# EasyEDA schematic SCH_fluffly_2_2024-03-27.json
TITLE: Sheet_1; REV: 1.0; Date: 2022-06-25; Sheet: 1/1; Company: Your Company
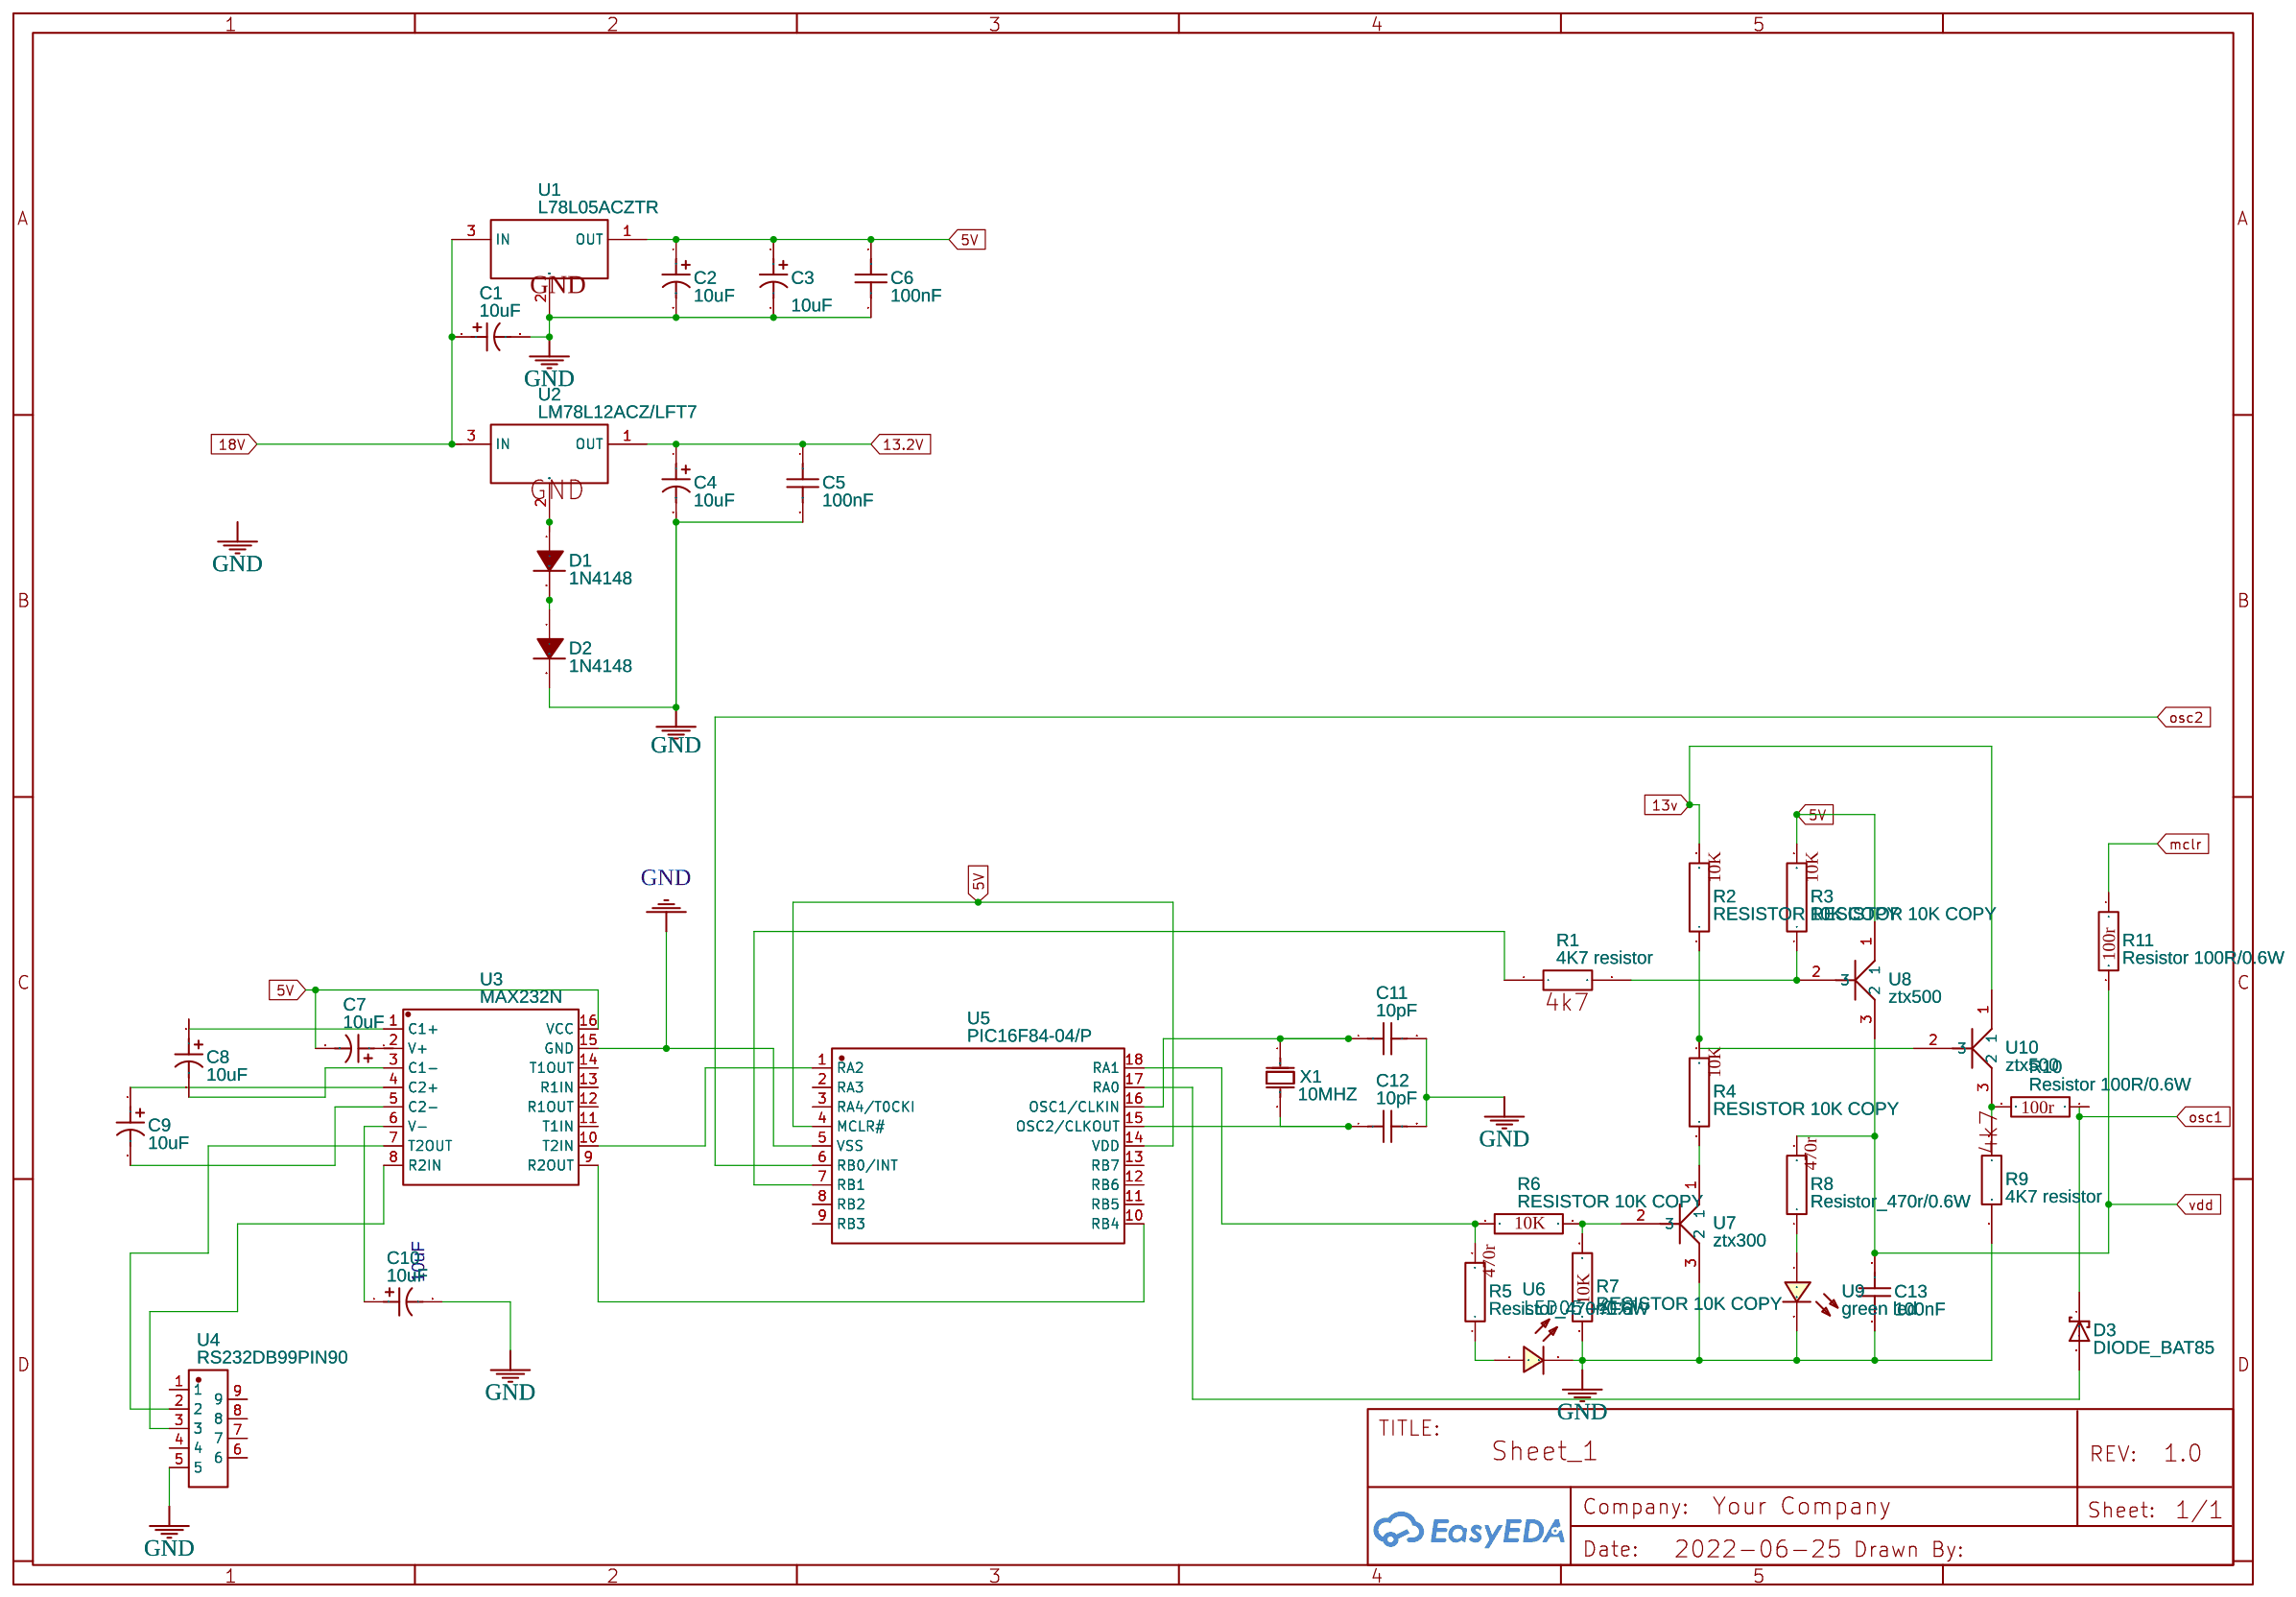
[diagram p0: schematic sheet]

## Parts
C1  10uF  [CAP-TH_BD8.0-P3.50-D0.6-FD_1]
C2  10uF  [CAP-TH_BD8.0-P3.50-D0.6-FD_1]
C3  10uF  [CAP-TH_BD8.0-P3.50-D0.6-FD_1]
C4  10uF  [CAP-TH_BD8.0-P3.50-D0.6-FD_1]
C5  100nF  [CAP-TH_L6.5-W3.0-P5.00-D0.6]
C6  100nF  [CAP-TH_L6.5-W3.0-P5.00-D0.6]
C7  10uF  [CAP-TH_BD8.0-P3.50-D0.6-FD_1]
C8  10uF  [CAP-TH_BD8.0-P3.50-D0.6-FD_1]
C9  10uF  [CAP-TH_BD8.0-P3.50-D0.6-FD_1]
C10  10uF  [CAP-TH_BD8.0-P3.50-D0.6-FD_1]
C11  10pF  [CAP-TH_L6.0-W3.5-P7.50-D1.0]
C12  10pF  [CAP-TH_L6.0-W3.5-P7.50-D1.0]
C13  100nF  [CAP-TH_L6.5-W3.0-P5.00-D0.6]
D1  1N4148  [DO-35_BD2.0-L4.0-P8.00-D0.5-FD]
D2  1N4148  [DO-35_BD2.0-L4.0-P8.00-D0.5-FD]
D3  DIODE_BAT85  [DIODE BAT85]
R1  4K7 resistor  [RESISTOR 4K7]
R2  RESISTOR 10K COPY  [RESISTOR 10K]
R3  RESISTOR 10K COPY  [RESISTOR 10K]
R4  RESISTOR 10K COPY  [RESISTOR 10K]
R5  Resistor_470r/0.6W  [ER_RESISTOR_470R/0.6_W]
R6  RESISTOR 10K COPY  [RESISTOR 10K]
R7  RESISTOR 10K COPY  [RESISTOR 10K]
R8  Resistor_470r/0.6W  [ER_RESISTOR_470R/0.6_W]
R9  4K7 resistor  [RESISTOR 4K7]
R10  Resistor 100R/0.6W  [ER RESISTOR 100R/0.6 W]
R11  Resistor 100R/0.6W  [ER RESISTOR 100R/0.6 W]
U1  L78L05ACZTR  [TO-92-3_L4.8-W3.7-P2.54-L]
U2  LM78L12ACZ/LFT7  [TO-92-3_L4.8-W3.7-P1.27-L]
U3  MAX232N  [PDIP-16_L19.7-W6.6-P2.54-LS7.8-BL]
U4  RS232DB99PIN90  [DB9-TH_DB9-H-F_C2888345]
U5  PIC16F84-04/P  [DIP-18_L23.0-W6.5-P2.54-LS7.6-BL]
U6  LED05-红灯  [LED-TH_LED-3MM_RED]
U7  ztx300  [TRANSISTOR]
U8  ztx500  [TRANSISTOR]
U9  green led  [LED-TH_LED-3MM_RED]
U10  ztx500  [TRANSISTOR]
X1  10MHZ  [OSC-TH_BD3.0-P1.10-D0.4]

## Library data of the parts
C1-C4 C7-C10 = RFS-50V100MG3#: Supplier: LCSC; Supplier Part: C2980594; Manufacturer: ELNA(伊娜); Contributor: lcsc; JLCPCB Part Class: Extended Part
C5 C6 C13 = DCS104Z26Y5VF58L5A0: Supplier: LCSC; Supplier Part: C2896068; Manufacturer: SHM(南方宏明); Contributor: lcsc
C11 C12 = CC45SL3FD100JYNNA: Supplier: LCSC; Supplier Part: C694205; Manufacturer: TDK; Contributor: LCSC; JLCPCB Part Class: Extended Part
D1 D2 = 1N4148: Supplier: LCSC; Manufacturer: SEMTECH; Supplier Part: C14516; JLCPCB Part Class: Extended Part
D3 = DIODE_BAT85: Contributor: Jr-YKZ
R1 R9 = 4K7 resistor: Contributor: enal007
R2-R4 R6 R7 = RESISTOR 10K COPY: Supplier Part: undefined; Contributor: pritams07
R5 R8 = Resistor_470r/0.6W: Supplier Part: undefined; Contributor: elpeewee
R10 R11 = Resistor 100R/0.6W: Supplier Part: undefined; Supplier: Conrad
U1 = L78L05ACZTR: Supplier: LCSC; Manufacturer: STMicroelectronics; Supplier Part: C118270; JLCPCB Part Class: Extended Part
U2 = LM78L12ACZ/LFT7: Supplier: LCSC; Supplier Part: C2868177; Manufacturer: TI(德州仪器); link: https://atta.szlcsc.comnull; Contributor: LCSC
U3 = MAX232N: Supplier: LCSC; Supplier Part: C353147; Manufacturer: Texas Instruments; Contributor: LCSC; JLCPCB Part Class: Extended Part
U4 = RS232DB99PIN90: Supplier: LCSC; Supplier Part: C9900003665; Manufacturer: null; Manufacturer Part: RS232DB99pin90度母座; Contributor: LCSC; JLCPCB Part Class: Extended Part
U5 = PIC16F84-04/P: Supplier: LCSC; Supplier Part: C184831; Manufacturer: Microchip Tech; Contributor: LCSC; JLCPCB Part Class: Extended Part
U6 U9 = LED05-红灯: Supplier: LCSC; Supplier Part: C9900009041; Manufacturer: null; Contributor: LCSC; JLCPCB Part Class: Extended Part
U7 U8 U10 = transistor: Contributor: VVN NNV
X1 = 509-0400A2020-00: Supplier: LCSC; Supplier Part: C389687; Manufacturer: XTY; Contributor: LCSC; JLCPCB Part Class: Extended Part

## Nets
5V: C2.1 C3.1 C6.1 C7.2 R3.2 U1.1(OUT) U3.16(VCC) U5.4(MCLR#) U5.14(VDD) U8.1
13.2V: C4.1 C5.1 U2.1(OUT)
13v: R2.2 U10.1
18V: C1.1 U1.3(IN) U2.3(IN)
GND: C1.2 C2.2 C3.2 C4.2 C5.2 C6.2 C10.2 C11.2 C12.2 C13.2 D2.2(C) R7.1 R9.2 U1.2(GND) U3.15(GND) U4.5 U5.5(VSS) U6.2 U7.3(2) U9.2
vdd: C13.1 R8.2 R11.2 U8.3(2)
mclr: R11.1
osc1: D3.1(K) R10.1
osc2: U5.6(RB0/INT)
Net-(C7-1): C7.1 U3.2(V+)
Net-(C8-1): C8.1 U3.1(C1+)
Net-(C8-2): C8.2 U3.3(C1-)
Net-(C9-1): C9.1 U3.4(C2+)
Net-(C9-2): C9.2 U3.5(C2-)
Net-(C10-1): C10.1 U3.6(V-)
Net-(C11-1): C11.1 U5.16(OSC1/CLKIN) X1.1(OSC1)
Net-(C12-1): C12.1 U5.15(OSC2/CLKOUT) X1.2(OSC2)
Net-(D1-1): D1.1(A) U2.2(GND)
Net-(D1-2): D1.2(C) D2.1(A)
Net-(D3-2): D3.2(A) U5.17(RA0)
Net-(R1-1): R1.1 U5.7(RB1)
Net-(R1-2): R1.2 R3.1 U8.2(3)
Net-(R2-1): R2.1 R4.2 U10.2(3)
Net-(R4-1): R4.1 U7.1
Net-(R5-1): R5.1 U6.1
Net-(R5-2): R5.2 R6.2 U5.18(RA1)
Net-(R6-1): R6.1 R7.2 U7.2(3)
Net-(R8-1): R8.1 U9.1
Net-(R9-1): R9.1 R10.2 U10.3(2)
Net-(U3-7): U3.7(T2OUT) U4.2
Net-(U3-8): U3.8(R2IN) U4.3
Net-(U3-9): U3.9(R2OUT) U5.10(RB4)
Net-(U3-10): U3.10(T2IN) U5.1(RA2)

Not connected (* = marked no-connect by the designer): U3 11(T1IN) 12(R1OUT) 13(R1IN) 14(T1OUT); U4 1 4 6 7 8 9; U5 2(RA3) 3(RA4/T0CKI) 8(RB2) 9(RB3) 11(RB5) 12(RB6) 13(RB7)

## Notes on the sheet
- 10uF
